# EAGLE design door_light (EAGLE 6.4)
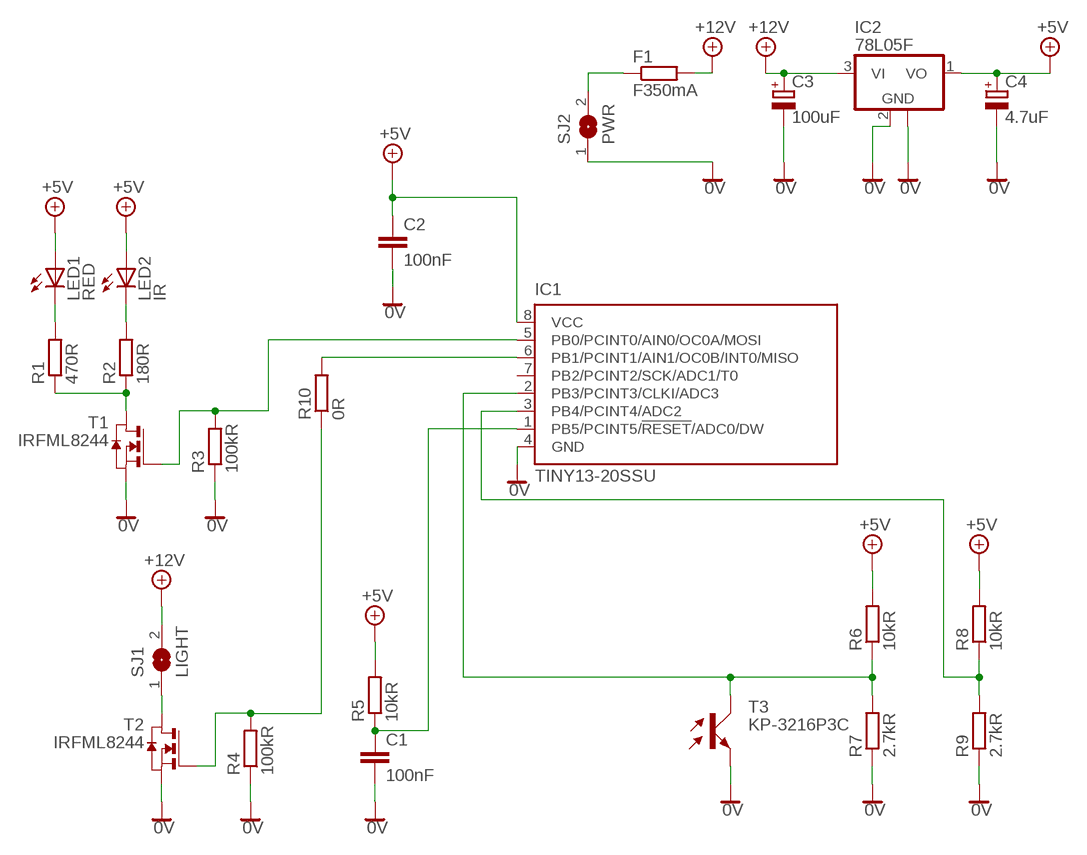
[diagram p0: schematic, sheet 1]

## Parts
C1  100nF  C-EUC1206  [C1206]
C2  100nF  C-EUC1206  [C1206]
C3  100uF  CPOL-EU153CLV-0810  [153CLV-0810]
C4  4.7uF  CPOL-EU153CLV-0405  [153CLV-0405]
F1  F350mA  R-EU_MELF0204W  [MINI_MELF-0204W]
IC1  TINY13-20SSU  [8S1]
IC2  78L05F  [SOT89]
LED1  RED  LEDCHIPLED_0603  [CHIPLED_0603]
LED2  IR  LEDCHIPLED_1206  [CHIPLED_1206]
R1  470R  R-EU_R0603  [R0603]
R2  180R  R-EU_R0603  [R0603]
R3  100kR  R-EU_R0603  [R0603]
R4  100kR  R-EU_R0603  [R0603]
R5  10kR  R-EU_R0603  [R0603]
R6  10kR  R-EU_R0603  [R0603]
R7  2.7kR  R-EU_R0603  [R0603]
R8  10kR  R-EU_R0603  [R0603]
R9  2.7kR  R-EU_R0603  [R0603]
R10  0R  R-EU_R1206W  [R1206W]
SJ1  LIGHT  SJW  [SJW]
SJ2  PWR  SJW  [SJW]
T1  IRFML8244  NMOSSOT23  [SOT-23]
T2  IRFML8244  NMOSSOT23  [SOT-23]
T3  KP-3216P3C  [OPTO-TRANS-SIEMENS_BP103]

## Nets
0V: C1.2 C2.2 C3.- C4.- IC1.4(GND) IC2.2(GND) IC2.2@1(GND) R3.1 R4.1 R7.1 R9.1 SJ2.1 T1.2(S) T2.2(S) T3.EMITER(E)
+5V: C2.1 C4.+ IC1.8(VCC) IC2.1(VO) LED1.A LED2.A R5.2 R6.2 R8.2
+12V: C3.+ F1.2 IC2.3(VI) SJ1.2
N$1: LED1.C R1.2
N$2: LED2.C R2.2
N$3: SJ1.1 T2.1(D)
N$4: R1.1 R2.1 T1.1(D)
N$5: R4.2 R10.1 T2.3(G)
N$8: F1.1 SJ2.2
N$9: C1.1 IC1.1(PB5/PCINT5/!RESET!/ADC0/DW) R5.1
N$12: IC1.2(PB3/PCINT3/CLKI/ADC3) R6.1 R7.2 T3.COLLECTOR(C)
N$13: IC1.6(PB1/PCINT1/AIN1/OC0B/INT0/MISO) R10.2
N$14: IC1.5(PB0/PCINT0/AIN0/OC0A/MOSI) R3.2 T1.3(G)
N$17: IC1.3(PB4/PCINT4/ADC2) R8.1 R9.2
Unconnected: IC1.7(PB2/PCINT2/SCK/ADC1/T0)

## Library data of the parts
C1 C2 = rcl:C-EU: CAPACITOR, European symbol
C3 C4 = rcl:CPOL-EU: POLARIZED CAPACITOR, European symbol
F1 R1-R10 = rcl:R-EU_: RESISTOR, European symbol
IC1 = atmel:TINY13: 8-bit AVR Microcontroller with 1K Bytes In-System Programmable Flash Source: http://www.atmel.com/dyn/resources/prod_documents/2535S.pdf; MPN: ATTINY13-20SSU; OC_FARNELL: 1455133; OC_NEWARK: 58M3771
IC2 = linear:78L*: POSITOIV-VOLTAGE REGULATORS Output up to 100 mA Source: http://focus.ti.com/lit/ds/symlink/ua78l05.pdf
LED1 LED2 = led:LED: LED OSRAM: - CHIPLED LG R971, LG N971, LY N971, LG Q971, LY Q971, LO R971, LY R971 LH N974, LH R974 LS Q976, LO Q976, LY Q976 LO Q996 - Hyper CHIPLED LW Q18S LB Q993, LB Q99A, LB R99A - SideLED LS A670, LO A670, LY A670, LG A670, LP A670 LB A673, LV A673, LT A673, LW A673 LH A674 LY A675 LS A676, LA A676, LO A676, LY A676, LW A676 LS A679, LY A679, LG A679 - Hyper Micro SIDELED® LS Y876, LA Y876, LO Y876, LY Y876 LT Y87S - SmartLED LW L88C, LW L88S LB L89C, LB L89S, LG L890 LS L89K, LO L89K, LY L89K LS L896, LA L896, LO L896, LY L896 - TOPLED LS T670, LO T670, LY T670, LG T670, LP T670 LSG T670, LSP T670, LSY T670, LOP T670, LYG T670 LG T671, LOG T671, LSG T671 LB T673, LV T673, LT T673, LW T673 LH T674 LS T676, LA T676, LO T676, LY T676, LB T676, LH T676, LSB T676, LW T676 LB T67C, LV T67C, LT T67C, LS T67K, LO T67K, LY T67K, LW E67C LS E67B, LA E67B, LO E67B, LY E67B, LB E67C, LV E67C, LT E67C LW T67C LS T679, LY T679, LG T679 LS T770, LO T770, LY T770, LG T770, LP T770 LB T773, LV T773, LT T773, LW T773 LH T774 LS E675, LA E675, LY E675, LS T675 LS T776, LA T776, LO T776, LY T776, LB T776 LHGB T686 LT T68C, LB T68C - Hyper Mini TOPLED® LB M676 - Mini TOPLED Santana® LG M470 LS M47K, LO M47K, LY M47K Source: http://www.osram.convergy.de LUXEON: - LUMILED® LXK2-PW12-R00, LXK2-PW12-S00, LXK2-PW14-U00, LXK2-PW14-V00 LXK2-PM12-R00, LXK2-PM12-S00, LXK2-PM14-U00 LXK2-PE12-Q00, LXK2-PE12-R00, LXK2-PE12-S00, LXK2-PE14-T00, LXK2-PE14-U00 LXK2-PB12-K00, LXK2-PB12-L00, LXK2-PB12-M00, LXK2-PB14-N00, LXK2-PB14-P00, LXK2-PB14-Q00 LXK2-PR12-L00, LXK2-PR12-M00, LXK2-PR14-Q00, LXK2-PR14-R00 LXK2-PD12-Q00, LXK2-PD12-R00, LXK2-PD12-S00 LXK2-PH12-R00, LXK2-PH12-S00 LXK2-PL12-P00, LXK2-PL12-Q00, LXK2-PL12-R00 Source: www.luxeon.com KINGBRIGHT: KA-3528ASYC Source: www.kingbright.com
SJ1 SJ2 = jumper:SJ: SMD solder JUMPER
T1 T2 = zetex:NMOSSOT23: MOS FET; OC_FARNELL: unknown; OC_NEWARK: unknown
T3 = opto-trans-smd:KP-3216P3C: PHOTO TRANSISTOR KINGBRIGHT ELECTRONIC KP-3216P3C package: 1206 wave length: 940nm max. voltage: 30V view angle: 120° len: transparent; OC_FARNELL: unknown; OC_NEWARK: unknown

## Board
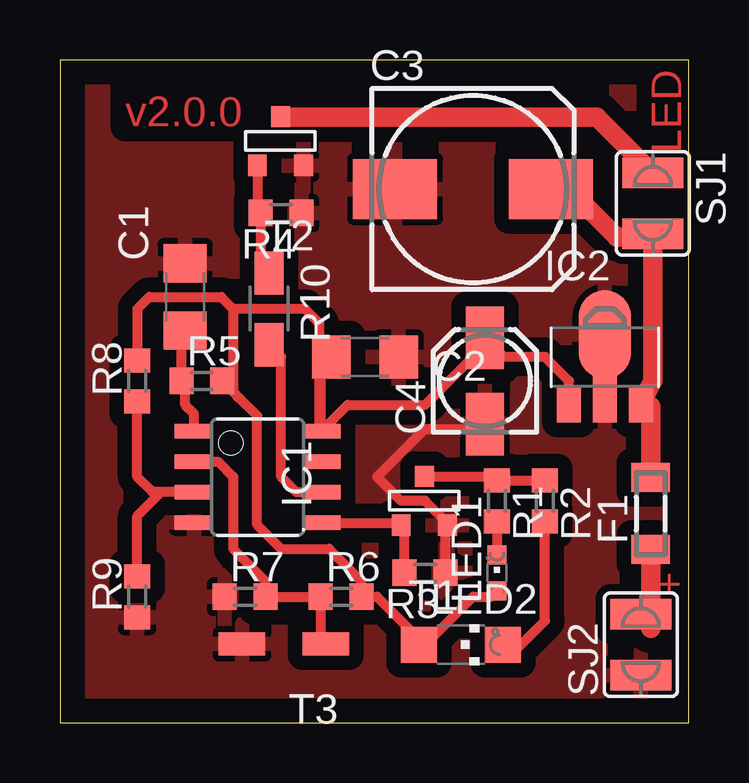
[diagram p1: board, top side]
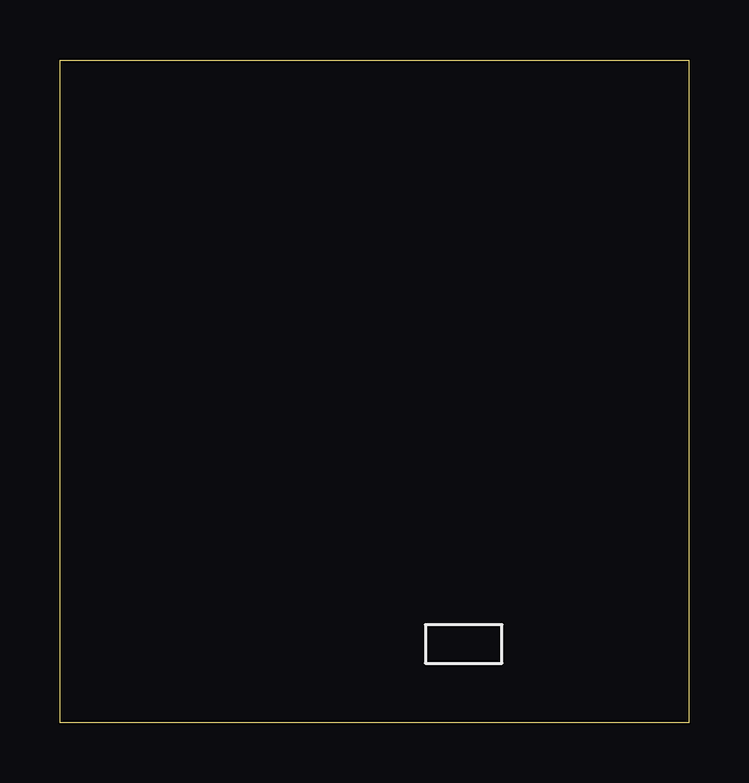
[diagram p2: board, bottom side, seen from below]

Size 26.22 x 27.63 mm. Coordinates in mm from the lower left corner, seen from the top.
Outline: 0,0 26.22,0 26.22,27.63 0,27.63 0,0
Copper layers (1*16): Top 0.035mm / dielectric 1.5mm / Bottom 0.035mm
Design rules "default": minimum track width 10mil, minimum drill 24mil, track to track 8mil, track to pad 8mil, pad to pad 8mil, via to via 8mil, smd to smd 8mil, copper to edge 40mil, drill to drill 8mil, minimum pad ring 10mil, minimum via ring 8mil, stop-mask expansion 4mil, vias tented up to drill 0mil, thermal gap 10mil

### Footprints (pad centres in the part's own frame; a part is rotated, then mirrored left to right if it is on the bottom)
C1206 = smd 1.6 x 1.8: 1 -1.4,0; 2 1.4,0
153CLV-0810 = smd 3.5 x 2.5: + 3.25,0; - -3.25,0
153CLV-0405 = smd 2.6 x 1.6: + 1.8,0; - -1.8,0
MINI_MELF-0204W = smd 1.2 x 1.6: 1 -1.5,0; 2 1.5,0
8S1 = smd 0.6 x 1.6: 1 -1.905,-2.654; 2 -0.645,-2.654; 3 0.625,-2.654; 4 1.895,-2.654; 5 1.905,2.654; 6 0.635,2.654; 7 -0.635,2.654; 8 -1.905,2.654
SOT89 = smd 1 x 1.5: 1 -1.499,-1.981; 3 1.499,-1.981 | smd 1 x 2: 2 0,-1.727 | smd 2.2 x 3.7: 2@1 0,0.94
CHIPLED_0603 = smd 0.8 x 0.8: A 0,-0.75; C 0,0.75
CHIPLED_1206 = smd 1.5 x 1.5: A 0,-1.75; C 0,1.75
R0603 = smd 1 x 1.1: 1 -0.85,0; 2 0.85,0
R1206W = smd 1.8 x 1.2: 1 -1.499,0; 2 1.499,0
SJW = smd 1.27 x 2.54: 1 -1.27,0; 2 1.27,0
SOT-23 = smd 0.787 x 0.889: 1 0.025,-1.016; 2 -0.94,1.016; 3 0.991,1.016
OPTO-TRANS-SIEMENS_BP103 = smd 1.93 x 0.965: COLLECTOR -1.37,0.47; EMITER 2.13,0.47

### Placement (x,y rotation side)
C1  5.22,17.75 90 top
C2  12.72,15.25 0 top
C3  17.22,22.25 0 top
C4  17.72,14.25 90 top
F1  24.63,8.72 90 top
IC1  8.24,10.24 270 top
IC2  22.72,15.25 0 top
LED1  18.22,6.25 0 top
LED2  16.72,3.25 270 top
R1  18.22,9.25 270 top
R2  20.22,9.25 270 top
R3  15.22,6.25 180 top
R4  9.22,21.25 180 top
R5  5.92,14.25 0 top
R6  11.72,5.25 0 top
R7  7.72,5.25 0 top
R8  3.22,14.25 90 top
R9  3.22,5.25 90 top
R10  8.72,17.25 270 top
SJ1  24.72,21.65 270 top
SJ2  24.22,3.25 90 top
T1  15.22,9.25 180 top
T2  9.22,24.25 180 top
T3  9.72,3.75 180 top

### Tracks (layer width: path | path; a pad name or v marks a point on that pad's centre or on a via)
0V
  Top 0.406: R3.1 16.07,8.14 T1.2 16.16,8.31 15.22,9.25 14.22,9.25 13.22,10.25 15.22,12.25 18.02,12.25 C4.-
  pour Top (isolate 0.61): 0.27,0.27 0.27,27.37 26.72,27.37 26.72,0.27
+5V
  Top 0.406: 7.22,17.25 7.22,13.8 | 7.22,17.25 6.72,17.75 3.72,17.75 3.22,17.25 R8.2 | 10.72,15.35 C2.1 10.82,14.65 10.89,14.58 IC1.8 | IC1.8 10.82,12.22 10.82,16.65 10.22,17.25 7.22,17.25 | IC1.8 12,13.25 15.22,13.25 17.72,15.75 C4.+ 18.52,15.25 20.22,15.25 21.22,14.25 IC2.1 | 15.22,3.25 13.22,5.25 R6.2 12.57,5.9 11.22,7.25 9.22,7.25 8.22,8.25 8.22,12.8 7.49,13.52 7.22,13.8 | 15.22,3.25 15.22,3.17 LED2.A | 15.22,3.25 17.22,5.25 17.97,5.25 LED1.A | 7.22,13.8 R5.2
+12V
  Top 0.406: 24.63,13.18 IC2.3 | C3.+ 21.22,22.25 | 23.59,20.25 SJ1.2
  Top 0.813: F1.2 24.63,13.18 | IC2.3 24.72,14.27 24.72,18.25 24.72,19.38 SJ1.2 | 21.22,22.25 23.22,20.25 23.59,20.25
N$1
  Top 0.406: R1.2 LED1.C
N$2
  Top 0.406: LED2.C 18.94,2.97 20.22,4.25 R2.2
N$3
  Top 0.406: T2.1 9.2,25.27 9.22,25.25
  Top 0.813: 9.22,25.25 22.39,25.25 SJ1.1
N$4
  Top 0.406: T1.1 18.22,10.27 R1.1 R2.1
N$5
  Top 0.406: T2.3 8.23,21.39 R4.2 8.37,19.1 R10.1
N$8
  Top 0.406: 24.63,3.93 SJ2.2
  Top 0.813: F1.1 24.63,3.93
N$9
  Top 0.406: IC1.1 5.59,12.88 5.22,13.25 5.22,14.1 R5.1 5.07,16.2 C1.1
N$12
  Top 0.406: IC1.2 6.58,10.88 7.22,10.25 7.22,7.25 8.57,5.9 R7.2 R6.1 | 10.83,5.29 R6.1 | R6.1 10.87,3.35 T3.COLLECTOR
N$13
  Top 0.406: IC1.6 9.87,9.6 9.22,10.25 9.22,15.25 R10.2
N$14
  Top 0.406: IC1.5 14.23,8.34 T1.3 14.37,8.09 R3.2
N$17
  Top 0.406: IC1.3 4.22,9.62 | 4.22,9.62 3.86,9.62 3.22,10.25 R8.1 | R9.2 3.22,8.62 4.22,9.62

### Text on the board
Top: v2.0.0 | LED | +